# EAGLE design TEMP (EAGLE 9.4.0)
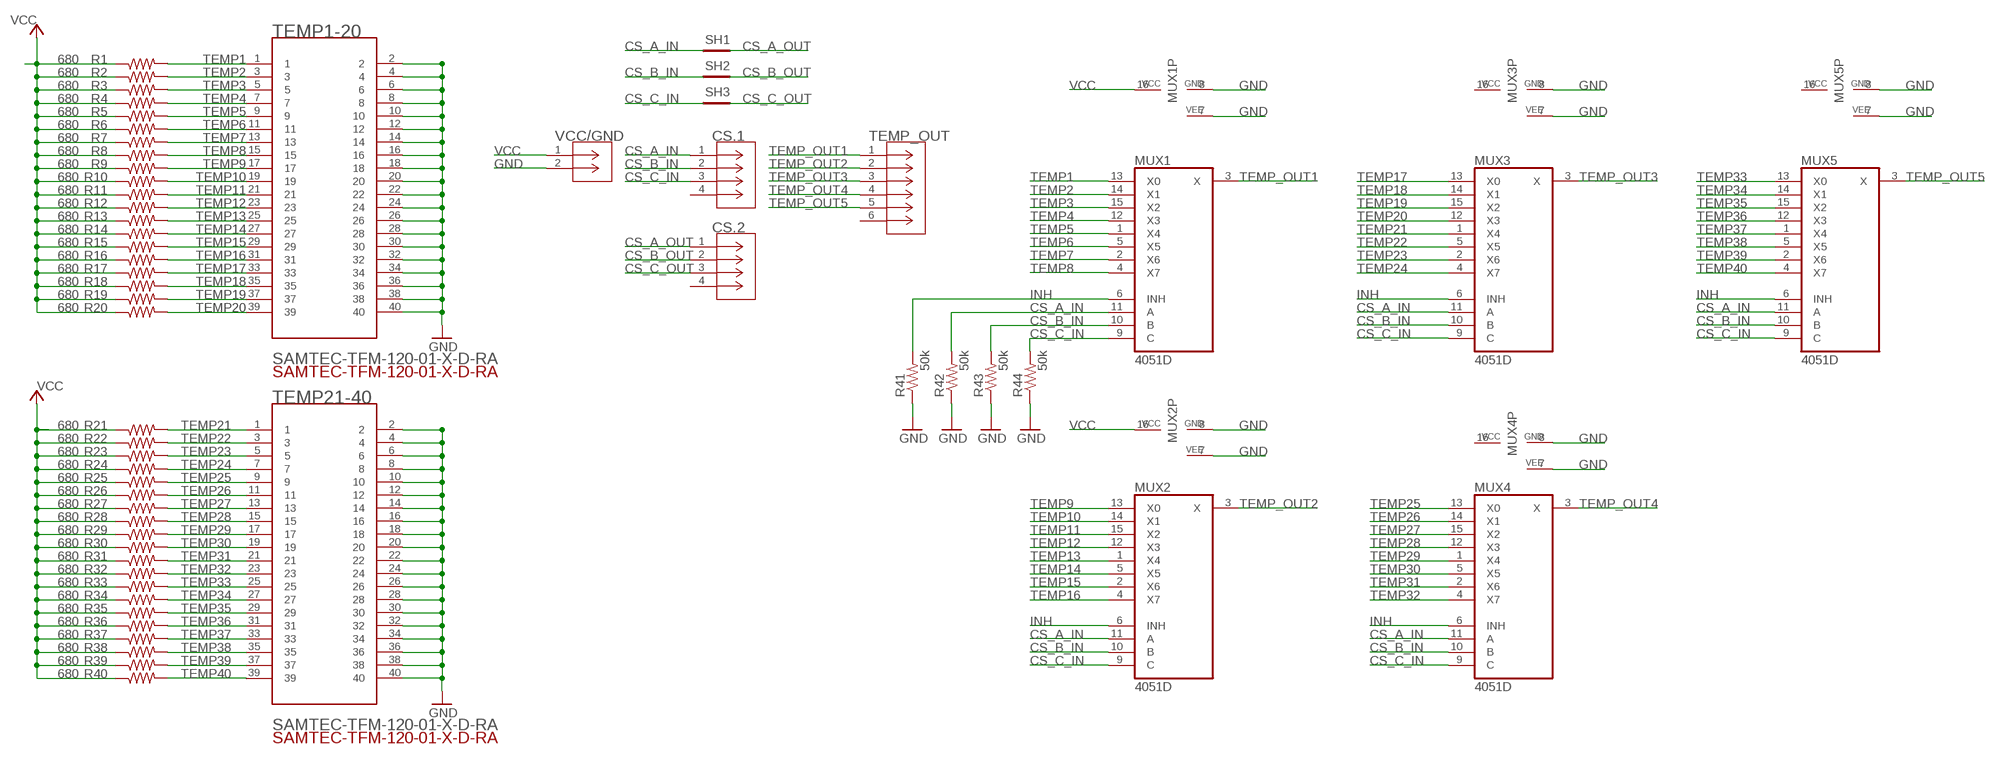
[diagram p0: schematic, sheet 1]

## Parts
CS.1  770968-1  [CONN4_770968-1]
CS.2  770968-1  [CONN4_770968-1]
MUX1  4051D  [SO16]
MUX2  4051D  [SO16]
MUX3  4051D  [SO16]
MUX4  4051D  [SO16]
MUX5  4051D  [SO16]
R1  680  R-US_R0805  [R0805]
R2  680  R-US_R0805  [R0805]
R3  680  R-US_R0805  [R0805]
R4  680  R-US_R0805  [R0805]
R5  680  R-US_R0805  [R0805]
R6  680  R-US_R0805  [R0805]
R7  680  R-US_R0805  [R0805]
R8  680  R-US_R0805  [R0805]
R9  680  R-US_R0805  [R0805]
R10  680  R-US_R0805  [R0805]
R11  680  R-US_R0805  [R0805]
R12  680  R-US_R0805  [R0805]
R13  680  R-US_R0805  [R0805]
R14  680  R-US_R0805  [R0805]
R15  680  R-US_R0805  [R0805]
R16  680  R-US_R0805  [R0805]
R17  680  R-US_R0805  [R0805]
R18  680  R-US_R0805  [R0805]
R19  680  R-US_R0805  [R0805]
R20  680  R-US_R0805  [R0805]
R21  680  R-US_R0805  [R0805]
R22  680  R-US_R0805  [R0805]
R23  680  R-US_R0805  [R0805]
R24  680  R-US_R0805  [R0805]
R25  680  R-US_R0805  [R0805]
R26  680  R-US_R0805  [R0805]
R27  680  R-US_R0805  [R0805]
R28  680  R-US_R0805  [R0805]
R29  680  R-US_R0805  [R0805]
R30  680  R-US_R0805  [R0805]
R31  680  R-US_R0805  [R0805]
R32  680  R-US_R0805  [R0805]
R33  680  R-US_R0805  [R0805]
R34  680  R-US_R0805  [R0805]
R35  680  R-US_R0805  [R0805]
R36  680  R-US_R0805  [R0805]
R37  680  R-US_R0805  [R0805]
R38  680  R-US_R0805  [R0805]
R39  680  R-US_R0805  [R0805]
R40  680  R-US_R0805  [R0805]
R41  50k  R-US_R0805  [R0805]
R42  50k  R-US_R0805  [R0805]
R43  50k  R-US_R0805  [R0805]
R44  50k  R-US_R0805  [R0805]
SH1  SHORTT5  [SHORT_TOP-50]
SH2  SHORTT5  [SHORT_TOP-50]
SH3  SHORTT5  [SHORT_TOP-50]
TEMP1-20  SAMTEC-TFM-120-01-X-D-RA  [SAMTEC-TFM-120-01-X-D-RA]
TEMP21-40  SAMTEC-TFM-120-01-X-D-RA  [SAMTEC-TFM-120-01-X-D-RA]
TEMP_OUT  1-770969-0  [CON6_2X3_P163_RAMNL]
VCC/GND  770966-1  [CONN2_770966-1]

## Nets
CS_A_IN: CS.1.1 MUX1.11(A) MUX2.11(A) MUX3.11(A) MUX4.11(A) MUX5.11(A) R42.2 SH1.1
CS_A_OUT: CS.2.1 SH1.2
CS_B_IN: CS.1.2 MUX1.10(B) MUX2.10(B) MUX3.10(B) MUX4.10(B) MUX5.10(B) R43.2 SH2.1
CS_B_OUT: CS.2.2 SH2.2
CS_C_IN: CS.1.3 MUX1.9(C) MUX2.9(C) MUX3.9(C) MUX4.9(C) MUX5.9(C) R44.2 SH3.1
CS_C_OUT: CS.2.3 SH3.2
GND: MUX1.7(VEE) MUX1.8(GND) MUX2.7(VEE) MUX2.8(GND) MUX3.7(VEE) MUX3.8(GND) MUX4.7(VEE) MUX4.8(GND) MUX5.7(VEE) MUX5.8(GND) R41.1 R42.1 R43.1 R44.1 TEMP1-20.2 TEMP1-20.4 TEMP1-20.6 TEMP1-20.8 TEMP1-20.10 TEMP1-20.12 TEMP1-20.14 TEMP1-20.16 TEMP1-20.18 TEMP1-20.20 TEMP1-20.22 TEMP1-20.24 TEMP1-20.26 TEMP1-20.28 TEMP1-20.30 TEMP1-20.32 TEMP1-20.34 TEMP1-20.36 TEMP1-20.38 TEMP1-20.40 TEMP21-40.2 TEMP21-40.4 TEMP21-40.6 TEMP21-40.8 TEMP21-40.10 TEMP21-40.12 TEMP21-40.14 TEMP21-40.16 TEMP21-40.18 TEMP21-40.20 TEMP21-40.22 TEMP21-40.24 TEMP21-40.26 TEMP21-40.28 TEMP21-40.30 TEMP21-40.32 TEMP21-40.34 TEMP21-40.36 TEMP21-40.38 TEMP21-40.40 VCC/GND.2
INH: MUX1.6(INH) MUX2.6(INH) MUX3.6(INH) MUX4.6(INH) MUX5.6(INH) R41.2
TEMP1: MUX1.13(X0) R1.2 TEMP1-20.1
TEMP2: MUX1.14(X1) R2.2 TEMP1-20.3
TEMP3: MUX1.15(X2) R3.2 TEMP1-20.5
TEMP4: MUX1.12(X3) R4.2 TEMP1-20.7
TEMP5: MUX1.1(X4) R5.2 TEMP1-20.9
TEMP6: MUX1.5(X5) R6.2 TEMP1-20.11
TEMP7: MUX1.2(X6) R7.2 TEMP1-20.13
TEMP8: MUX1.4(X7) R8.2 TEMP1-20.15
TEMP9: MUX2.13(X0) R9.2 TEMP1-20.17
TEMP10: MUX2.14(X1) R10.2 TEMP1-20.19
TEMP11: MUX2.15(X2) R11.2 TEMP1-20.21
TEMP12: MUX2.12(X3) R12.2 TEMP1-20.23
TEMP13: MUX2.1(X4) R13.2 TEMP1-20.25
TEMP14: MUX2.5(X5) R14.2 TEMP1-20.27
TEMP15: MUX2.2(X6) R15.2 TEMP1-20.29
TEMP16: MUX2.4(X7) R16.2 TEMP1-20.31
TEMP17: MUX3.13(X0) R17.2 TEMP1-20.33
TEMP18: MUX3.14(X1) R18.2 TEMP1-20.35
TEMP19: MUX3.15(X2) R19.2 TEMP1-20.37
TEMP20: MUX3.12(X3) R20.2 TEMP1-20.39
TEMP21: MUX3.1(X4) R21.2 TEMP21-40.1
TEMP22: MUX3.5(X5) R22.2 TEMP21-40.3
TEMP23: MUX3.2(X6) R23.2 TEMP21-40.5
TEMP24: MUX3.4(X7) R24.2 TEMP21-40.7
TEMP25: MUX4.13(X0) R25.2 TEMP21-40.9
TEMP26: MUX4.14(X1) R26.2 TEMP21-40.11
TEMP27: MUX4.15(X2) R27.2 TEMP21-40.13
TEMP28: MUX4.12(X3) R28.2 TEMP21-40.15
TEMP29: MUX4.1(X4) R29.2 TEMP21-40.17
TEMP30: MUX4.5(X5) R30.2 TEMP21-40.19
TEMP31: MUX4.2(X6) R31.2 TEMP21-40.21
TEMP32: MUX4.4(X7) R32.2 TEMP21-40.23
TEMP33: MUX5.13(X0) R33.2 TEMP21-40.25
TEMP34: MUX5.14(X1) R34.2 TEMP21-40.27
TEMP35: MUX5.15(X2) R35.2 TEMP21-40.29
TEMP36: MUX5.12(X3) R36.2 TEMP21-40.31
TEMP37: MUX5.1(X4) R37.2 TEMP21-40.33
TEMP38: MUX5.5(X5) R38.2 TEMP21-40.35
TEMP39: MUX5.2(X6) R39.2 TEMP21-40.37
TEMP40: MUX5.4(X7) R40.2 TEMP21-40.39
TEMP_OUT1: MUX1.3(X) TEMP_OUT.1
TEMP_OUT2: MUX2.3(X) TEMP_OUT.2
TEMP_OUT3: MUX3.3(X) TEMP_OUT.3
TEMP_OUT4: MUX4.3(X) TEMP_OUT.4
TEMP_OUT5: MUX5.3(X) TEMP_OUT.5
VCC: MUX1.16(VCC) MUX2.16(VCC) R1.1 R2.1 R3.1 R4.1 R5.1 R6.1 R7.1 R8.1 R9.1 R10.1 R11.1 R12.1 R13.1 R14.1 R15.1 R16.1 R17.1 R18.1 R19.1 R20.1 R21.1 R22.1 R23.1 R24.1 R25.1 R26.1 R27.1 R28.1 R29.1 R30.1 R31.1 R32.1 R33.1 R34.1 R35.1 R36.1 R37.1 R38.1 R39.1 R40.1 VCC/GND.1
Unconnected: CS.1.4 CS.2.4 TEMP_OUT.6

## Power pins joined to a net without a drawn wire
VCC: MUX3.16(VCC) MUX4.16(VCC) MUX5.16(VCC)

## Library data of the parts
CS.1 CS.2 = IowaFormula:770968-1; MANUFACTURER_PART_NUMBER: 7709681; VENDOR: TE Connectivity
MUX1-MUX5 = 40xx:4051: 8-channel ANALOG MULTIPLEXER
R1-R44 = rcl:R-US_: RESISTOR, American symbol; SPICEPREFIX: R
SH1-SH3 = shorts:SHORT: Short between two nets; BOM: no
TEMP1-20 TEMP21-40 = SAMTEC-TFM-120-01-X-D-RA:SAMTEC-TFM-120-01-X-D-RA
TEMP_OUT = IowaFormula:1-770969-0; MANUFACTURER_PART_NUMBER: 17709690; VENDOR: TE Connectivity
VCC/GND = IowaFormula:770966-1; MANUFACTURER_PART_NUMBER: 7709661; VENDOR: TE Connectivity

## Board
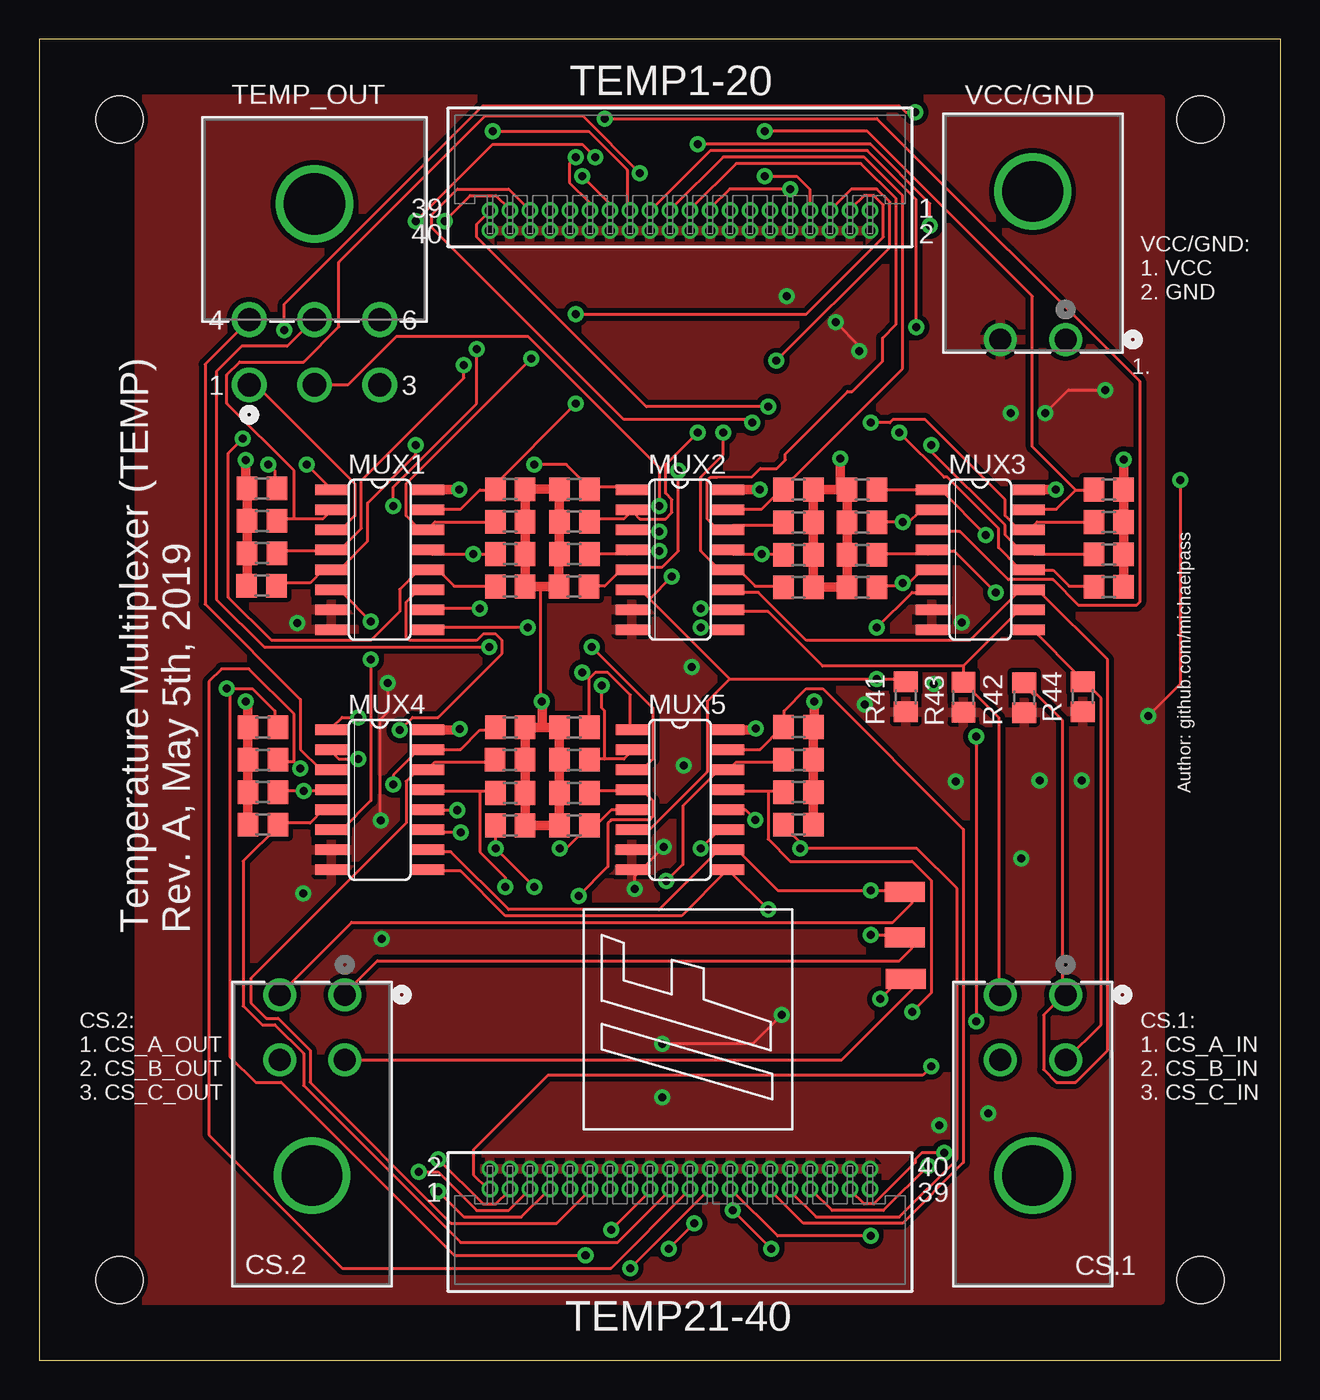
[diagram p1: board, top side]
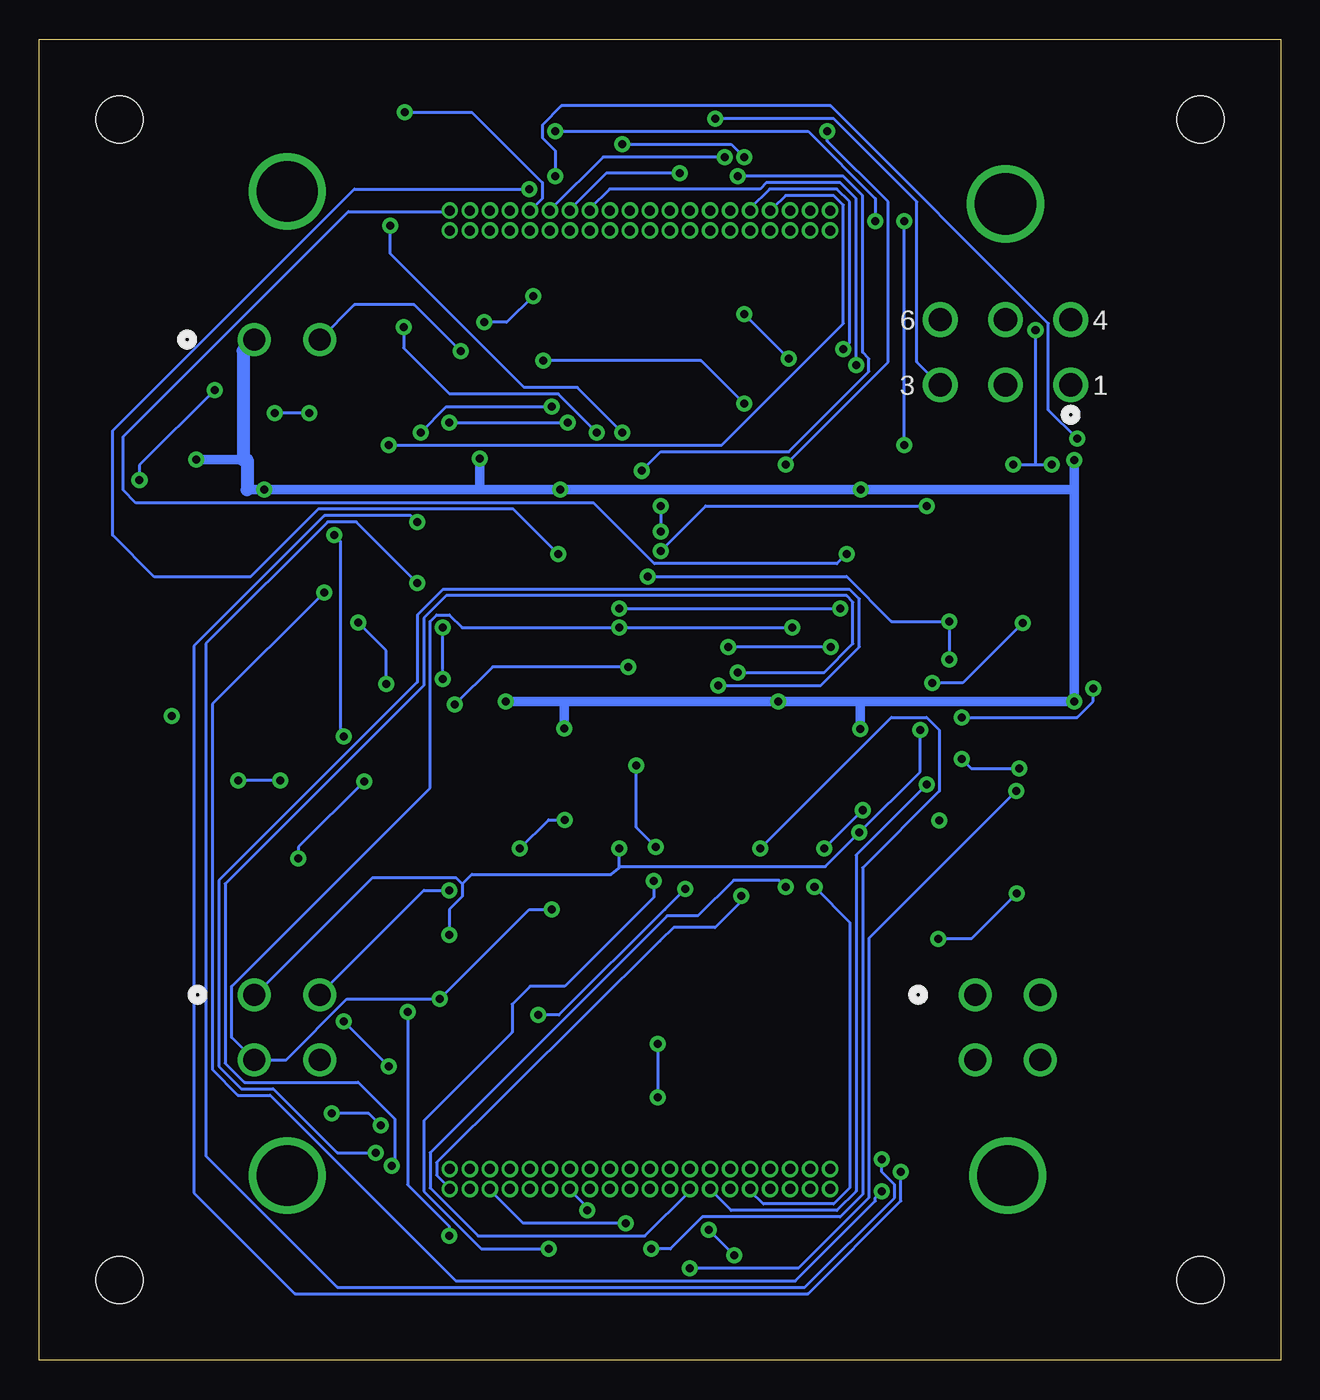
[diagram p2: board, bottom side, seen from below]

Size 78.74 x 83.82 mm. Coordinates in mm from the lower left corner, seen from the top.
Outline: 0,0 78.74,0 78.74,83.82 0,83.82 0,0
Copper layers (1*16): Top 0.035mm / dielectric 1.5mm / Bottom 0.035mm
Design rules "default *": minimum track width 8mil, minimum drill 20mil, track to track 8mil, track to pad 8mil, pad to pad 8mil, via to via 8mil, smd to smd 8mil, copper to edge 10mil, drill to drill 8mil, minimum pad ring 8mil, minimum via ring 10mil, stop-mask expansion 4mil, vias tented up to drill 25mil, thermal gap 10mil
Holes 3 mm at 73.66,78.74 5.08,78.74 5.08,5.08 73.66,5.08

### Footprints (pad centres in the part's own frame; a part is rotated, then mirrored left to right if it is on the bottom)
CONN4_770968-1 = drill 1.397 pad 1.905: 1 4.14,4.14; 2 0,4.14; 3 4.14,0; 4 0,0 | drill 3.861 pad 3.861: 5 2.057,-7.341
SO16 = smd 0.66 x 2.032: 1 -4.445,-3.073; 2 -3.175,-3.073; 3 -1.905,-3.073; 4 -0.635,-3.073; 5 0.635,-3.073; 6 1.905,-3.073; 7 3.175,-3.073; 8 4.445,-3.073; 9 4.445,3.073; 10 3.175,3.073; 11 1.905,3.073; 12 0.635,3.073; 13 -0.635,3.073; 14 -1.905,3.073; 15 -3.175,3.073; 16 -4.445,3.073
R0805 = smd 1.3 x 1.5: 1 -0.95,0; 2 0.95,0
SHORT_TOP-50 = smd 1.27 x 1.27: 1 0.635,0; 2 -0.635,0
SAMTEC-TFM-120-01-X-D-RA = drill 0.635 pad 1.016: 1 -12.065,3.238; 2 -12.065,4.508; 3 -10.795,3.238; 4 -10.795,4.508; 5 -9.525,3.238; 6 -9.525,4.508; 7 -8.255,3.238; 8 -8.255,4.508; 9 -6.985,3.238; 10 -6.985,4.508; 11 -5.715,3.238; 12 -5.715,4.508; 13 -4.445,3.238; 14 -4.445,4.508; 15 -3.175,3.238; 16 -3.175,4.508; 17 -1.905,3.238; 18 -1.905,4.508; 19 -0.635,3.238; 20 -0.635,4.508; 21 0.635,3.238; 22 0.635,4.508; 23 1.905,3.238; 24 1.905,4.508; 25 3.175,3.238; 26 3.175,4.508; 27 4.445,3.238; 28 4.445,4.508; 29 5.715,3.238; 30 5.715,4.508; 31 6.985,3.238; 32 6.985,4.508; 33 8.255,3.238; 34 8.255,4.508; 35 9.525,3.238; 36 9.525,4.508; 37 10.795,3.238; 38 10.795,4.508; 39 12.065,3.238; 40 12.065,4.508
CON6_2X3_P163_RAMNL = drill 1.473 pad 1.981: 1 -8.28,-4.14; 2 -4.14,-4.14; 3 0,-4.14; 4 -8.28,0; 5 -4.14,0; 6 0,0 | drill 3.912 pad 3.912: 7 -4.14,7.341
CONN2_770966-1 = drill 1.397 pad 1.905: 1 -4.14,0; 2 0,0 | drill 3.861 pad 3.861: 3 -2.057,-9.398

### Placement (x,y rotation side)
CS.1  60.96,19.05 0 top
CS.2  15.24,19.05 0 top
MUX1  21.59,50.8 270 top
MUX2  40.64,50.8 270 top
MUX3  59.69,50.8 270 top
MUX4  21.59,35.56 270 top
MUX5  40.64,35.56 270 top
R1  29.87,51.16 180 top
R2  29.87,53.21 180 top
R3  29.87,55.27 180 top
R4  29.87,49.1 180 top
R5  14.12,55.32 0 top
R6  14.1,49.15 0 top
R7  14.12,53.26 0 top
R8  14.12,51.21 0 top
R9  48.16,51.1 180 top
R10  48.16,53.16 180 top
R11  48.16,55.24 180 top
R12  48.16,49.05 180 top
R13  33.93,55.27 0 top
R14  33.91,49.1 0 top
R15  33.93,53.21 0 top
R16  33.93,51.16 0 top
R17  67.84,51.13 180 top
R18  67.84,53.19 180 top
R19  67.84,55.24 180 top
R20  67.84,49.07 180 top
R21  52.2,55.24 0 top
R22  52.2,49.05 0 top
R23  52.2,53.16 0 top
R24  52.2,51.1 0 top
R25  29.87,35.99 180 top
R26  29.84,38.1 180 top
R27  29.87,40.16 180 top
R28  29.87,33.93 180 top
R29  14.17,40.16 0 top
R30  14.17,33.99 0 top
R31  14.17,38.1 0 top
R32  14.17,36.04 0 top
R33  48.16,36.04 180 top
R34  48.16,38.1 180 top
R35  48.16,40.18 180 top
R36  48.16,33.99 180 top
R37  33.93,40.16 0 top
R38  33.93,33.93 0 top
R39  33.93,38.1 0 top
R40  33.93,35.99 0 top
R41  54.97,42.09 90 top
R42  62.48,42.04 90 top
R43  58.62,42.06 90 top
R44  66.19,42.11 90 top
SH1  54.89,26.82 180 top
SH2  54.89,29.72 180 top
SH3  54.97,24.21 180 top
TEMP1-20  40.64,76.2 180 top
TEMP21-40  40.64,7.62 0 top
TEMP_OUT  21.59,66.04 0 top
VCC/GND  60.96,64.77 180 top

### Tracks (layer width: path | path; a pad name or v marks a point on that pad's centre or on a via)
CS_A_IN  (via drill 0.51)
  Top 0.203: MUX2.11 43.79,48.72 45.62,48.72 48.67,45.67 59.03,45.67 62.08,48.72 62.69,48.72 MUX3.11 62.89,48.72 63.5,48.72 67.77,44.45 67.77,19.66 65.73,17.63 64.52,17.63 63.7,18.44 63.7,21.89 64.92,23.11 CS.1.1 64.92,23.32 64.92,40.59 63.3,42.22 63.09,42.22 62.48,42.82 R42.2 | v52.73,26.98 54.15,26.98 SH1.1 | v26.72,33.48 24.69,33.48 MUX4.11 | v41.96,32.46 42.98,33.48 43.59,33.48 MUX5.11 | v22.86,39.98 23.67,40.79 25.3,40.79 29.36,44.86 29.36,45.67 28.96,46.08 28.14,46.08 27.74,45.67 23.47,45.67 23.27,45.87 23.27,48.11 23.88,48.72 24.49,48.72 MUX1.11
  Bottom 0.203: v52.73,26.98 52.73,28.6 51.92,29.41 51.92,30.23 | 51.92,30.23 52.32,30.63 57.61,30.63 64.92,23.32 CS.1.1 | 41.96,31.32 28.88,31.32 v26.72,33.48 22.86,37.34 v22.86,39.98 | 51.92,30.23 51.31,30.84 42.45,30.84 41.96,31.23 41.96,31.32 | 41.96,31.32 v41.96,32.46
CS_A_OUT
  Top 0.203: SH1.2 55.37,26.77 55.37,26.16 54.56,25.35 21.44,25.35 19.41,23.32 CS.2.1
CS_B_IN  (via drill 0.51)
  Top 0.203: SH2.1 54.15,29.82 v52.73,29.82 46.84,29.82 44.4,32.26 43.79,32.26 MUX5.10 43.59,32.26 42.98,32.26 39.32,28.6 29.77,28.6 26.11,32.26 24.69,32.26 MUX4.10 | v27.94,47.7 24.69,47.7 MUX1.10 | v41.96,47.7 43.59,47.7 MUX2.10 43.79,47.5 46.23,47.5 49.68,44.04 58.62,44.04 | 58.62,44.04 58.62,43.03 | 58.62,44.04 62.08,47.5 62.69,47.5 MUX3.10 | 58.62,43.03 60.86,40.79 60.86,23.32 CS.1.2 | 58.62,43.03 R43.2
  Bottom 0.203: v41.96,47.7 v27.94,47.7 | v52.73,29.82 54.36,29.82 60.86,23.32 CS.1.2
CS_B_OUT
  Top 0.203: SH2.2 55.37,29.62 55.37,29.01 54.15,27.79 19.81,27.79 15.34,23.32 CS.2.2
CS_C_IN  (via drill 0.51)
  Top 0.203: MUX4.9 24.69,31.04 26.72,31.04 29.57,28.19 40.74,28.19 43.59,31.04 MUX5.9 v46.23,28.6 | v30.99,46.48 24.69,46.48 MUX1.9 | v41.96,46.48 43.59,46.48 MUX2.9 | MUX3.9 62.89,46.48 66.14,43.23 R44.2 66.34,43.03 67.36,42.01 67.36,21.29 65.13,19.05 CS.1.3 | v53.34,22.91 54.15,23.72 54.15,24.13 SH3.1
  Bottom 0.203: v30.99,46.48 v41.96,46.48 51.92,46.48 52.73,47.3 53.54,47.3 53.95,46.89 53.95,36.32 66.55,23.72 66.55,20.47 65.13,19.05 CS.1.3 63.09,19.05 59.23,22.91 v53.34,22.91 47.65,28.6 v46.23,28.6
CS_C_OUT
  Top 0.203: CS.2.3 50.9,19.05 55.58,23.72 55.58,24.13 SH3.2
GND  (via drill 0.51)
  Top 0.203: v47.09,21.89 45.26,20.07 v39.52,20.07 | v37.77,29.9 37.77,30.71 v39.62,32.56 | v22.1,42.98 22.1,41.15 21.59,40.64 21.59,34.31 v21.64,34.27 | v50.52,65.86 52.02,64.36 v52.02,64.03 | v63.8,60.1 65.28,61.57 v67.61,61.57 | v72.39,55.85 72.39,42.9 v70.36,40.87
  Bottom 0.203: v41.38,43.99 49.99,43.99 v52.38,41.6 | v37.77,29.9 39.06,28.6 39.08,28.6 45.79,21.89 v47.09,21.89 | v39.52,20.07 v39.52,16.69 | v39.62,32.56 40.87,33.81 v40.87,37.74 | v16.74,29.62 19.61,26.75 v21.72,26.75 | v58.14,36.73 62.31,32.56 v62.31,31.85 | v57.1,14.88 57.86,15.65 v60.2,15.65 | v63.45,36.78 v66.12,36.78 | v56.74,42.9 56.74,45.03 v58.52,46.81 | v16.36,46.79 20.17,42.98 v22.1,42.98 | v47.42,67.54 49.1,65.86 v50.52,65.86 | v52.02,64.03 54.97,66.98 58.75,66.98 VCC/GND.2 | v61.62,60.1 v63.8,60.1 | v67.61,61.57 72.39,56.79 v72.39,55.85
  pour Top (isolate 0.305): 6.35,3.81 6.35,80.01 71.12,80.01 71.12,3.81
INH  (via drill 0.51)
  Top 0.203: v21.03,44.45 21.03,35.51 19.2,33.68 18.59,33.68 MUX4.6 | v21.03,46.89 19.2,48.72 18.59,48.72 MUX1.6 | 43.79,43.23 v53.14,43.23 54.97,43.23 R41.2 | 38.71,48.31 38.3,48.72 37.69,48.72 MUX2.6 | 38.71,48.31 43.79,43.23 | 43.79,43.23 42.37,41.81 42.37,37.34 38.71,33.68 37.69,33.68 MUX5.6 | v53.14,46.48 55.37,48.72 56.59,48.72 MUX3.6 | 38.71,48.31 v40.13,49.73
  Bottom 0.203: v21.03,44.45 v21.03,46.89 24.69,46.89 27.53,49.73 v40.13,49.73 | v53.14,43.23 v53.14,46.48
TEMP1  (via drill 0.51)
  Top 0.203: R1.2 v27.53,51.16 24.89,51.16 24.69,51.36 MUX1.13
  Bottom 0.203: v27.53,51.16 28.14,50.55 39.73,50.55 43.59,54.41 72.62,54.41 73.43,55.22 73.43,58.6 59.13,72.9 52.73,72.9 TEMP1-20.1
TEMP2  (via drill 0.51)
  Top 0.203: R2.2 28.75,53.19 25.09,53.19 24.69,52.78 MUX1.14 24.49,52.78 24.08,52.78 23.27,53.59 23.27,55.63 v31.19,63.55 | v34.04,66.4 48.67,66.4 53.54,71.27 53.54,73.3 52.93,73.91 52.32,73.91 51.51,73.1 TEMP1-20.3
  Bottom 0.203: v31.19,63.55 v34.04,66.4
TEMP3  (via drill 0.51)
  Top 0.203: MUX1.15 24.69,54 26.72,54 27.94,55.22 28.75,55.22 R3.2 28.75,55.42 v34.04,60.71 | v46.76,63.42 53.95,70.61 53.95,73.51 53.14,74.32 51.51,74.32 50.29,73.1 TEMP1-20.5
  Bottom 0.203: v46.76,63.42 36.75,63.42 v34.04,60.71
TEMP4  (via drill 0.51)
  Top 0.203: R4.2 28.75,49.12 26.31,49.12 25.3,50.14 24.69,50.14 MUX1.12 24.49,50.14 24.08,50.14 22.86,48.92 22.86,47.5 21.03,45.67 14.73,45.67 11.99,48.41 11.99,57.56 v12.9,58.47 | v46.02,75.13 48.06,75.13 48.87,74.32 48.87,73.1 TEMP1-20.7
  Bottom 0.203: v46.02,75.13 46.02,76.76 46.84,77.57 46.84,78.38 45.62,79.6 28.55,79.6 14.73,65.79 14.73,60.3 v12.9,58.47
TEMP5  (via drill 0.51)
  Top 0.203: v14.53,56.84 14.94,56.44 14.94,55.42 R5.2 | v16.97,56.84 18.39,55.42 MUX1.1 | v55.58,79.2 54.97,79.2 54.56,79.6 28.12,79.6 15.54,67.03 v15.54,65.38
  Bottom 0.203: v16.97,56.84 15.54,56.84 | 15.54,56.84 v14.53,56.84 | v55.58,79.2 51.31,79.2 46.84,74.73 46.84,73.71 47.45,73.1 TEMP1-20.9 | 15.54,56.84 v15.54,65.38
TEMP6  (via drill 0.51)
  Top 0.203: R6.2 15.14,49.33 17.17,49.33 17.98,50.14 18.39,50.14 MUX1.5 18.59,50.34 19.2,50.34 20.83,51.97 20.83,54.41 23.88,57.45 v23.88,58.06 | v35.26,76.35 34.44,77.17 28.75,77.17 v23.88,72.29
  Bottom 0.203: v35.26,76.35 42.98,76.35 46.23,73.1 TEMP1-20.11 | v23.88,58.06 v23.88,72.29
TEMP7  (via drill 0.51)
  Top 0.203: 16.15,53.39 17.98,53.39 18.39,53.8 MUX1.2 | 16.15,53.39 15.14,53.39 R7.2 | v38.1,75.34 34.47,78.97 28.3,78.97 19,69.67 19,65.58 16.76,63.35 12.7,63.35 11.89,62.53 11.89,60.71 16.15,56.44 16.15,53.39
  Bottom 0.203: v38.1,75.34 42.77,75.34 45.01,73.1 TEMP1-20.13
TEMP8  (via drill 0.51)
  Top 0.203: R8.2 15.14,51.36 18.39,51.36 MUX1.4 18.59,51.56 19.2,51.56 20.42,52.78 20.42,55.83 26.92,62.33 v26.92,63.14
  Bottom 0.203: v26.92,63.14 26.92,73.71 27.94,74.73 32.61,74.73 33.02,74.32 42.57,74.32 43.79,73.1 TEMP1-20.15
TEMP9  (via drill 0.51)
  Top 0.203: MUX2.13 43.99,51.16 v45.82,51.16 47.04,51.16 R9.2 | v47.65,74.32 43.79,74.32 42.57,73.1 TEMP1-20.17
  Bottom 0.203: v47.65,74.32 58.75,74.32 74.09,58.98 74.09,52.35 71.45,49.71 65.35,49.71 61.06,54 48.67,54 v45.82,51.16
TEMP10
  Top 0.203: R10.2 47.04,52.98 43.99,52.98 MUX2.14 43.59,52.78 42.98,52.78 42.37,53.39 42.37,55.83 42.57,56.03 42.98,56.03 45.21,56.06 45.74,56.59 46.79,56.59 47.32,57.12 47.32,57.51 51.28,61.47 51.56,61.47 53.49,63.4 53.49,64.87 54.36,65.73 54.36,73.71 52.12,75.95 44.2,75.95 41.35,73.1 TEMP1-20.19
TEMP11
  Top 0.203: MUX2.15 43.79,54 45.82,54 47.04,55.22 R11.2 47.24,55.42 54.76,62.94 54.76,73.91 52.32,76.35 43.38,76.35 40.13,73.1 TEMP1-20.21
TEMP12  (via drill 0.51)
  Top 0.203: R12.2 47.04,49.12 45.41,49.12 44.4,50.14 43.79,50.14 MUX2.12 43.59,50.34 42.98,50.34 41.96,51.36 41.96,56.03 43.38,57.45 v43.38,58.88 | v55.63,65.56 55.63,73.66 52.53,76.76 42.57,76.76 38.91,73.1 TEMP1-20.23
  Bottom 0.203: v55.63,65.56 55.63,64.24 52.7,61.32 45.82,61.32 v43.38,58.88
TEMP13  (via drill 0.51)
  Top 0.203: MUX2.1 37.49,55.42 35.05,55.42 R13.2 34.85,55.42 33.43,56.84 v31.39,56.84 | v28.75,77.98 34.85,77.98 37.29,75.54 37.29,73.1 TEMP1-20.25
  Bottom 0.203: v28.75,77.98 28.75,77.37 24.89,73.51 24.89,63.35 v31.39,56.84
TEMP14  (via drill 0.51)
  Top 0.203: R14.2 35.05,49.12 35.87,49.12 36.88,50.14 37.49,50.14 MUX2.5 37.69,50.34 39.52,50.34 40.54,51.36 v40.54,56.44 | v34.44,75.13 36.07,73.51 36.07,73.1 TEMP1-20.27
  Bottom 0.203: v34.44,75.13 27.74,75.13 26.52,73.91 26.52,63.96 26.11,63.55 26.11,62.74 31.19,57.66 39.32,57.66 v40.54,56.44
TEMP15  (via drill 0.51)
  Top 0.203: R15.2 35.05,53.39 37.08,53.39 37.49,53.8 MUX2.2 37.69,53.8 38.1,53.39 39.73,53.39 40.13,53.8 40.13,54.61 39.73,55.02 39.73,56.84 v41.76,58.88 | v34.04,76.35 33.63,75.95 33.63,74.73 34.85,73.51 34.85,73.1 TEMP1-20.29 | v41.76,77.17 52.73,77.17 56.49,73.41 v56.49,71.98
  Bottom 0.203: v34.04,76.35 34.85,77.17 v41.76,77.17 | v56.49,71.98 56.49,70.23 47.98,61.72 44.6,61.72 v41.76,58.88
TEMP16  (via drill 0.51)
  Top 0.203: R16.2 37.29,51.16 MUX2.4 37.69,51.36 v39.32,51.36 | v27.74,64.16 27.74,60.71 22.45,55.42 v22.45,54.2
  Bottom 0.203: v27.74,64.16 27.33,64.57 27.33,73.51 28.14,74.32 32.41,74.32 33.63,73.1 TEMP1-20.31 | v22.45,54.2 36.47,54.2 v39.32,51.36
TEMP17  (via drill 0.51)
  Top 0.203: R17.2 66.75,51.16 63.09,51.16 62.89,51.36 MUX3.13 62.69,51.56 62.08,51.56 61.27,52.38 61.27,52.98 56.59,57.66 v56.59,58.06
  Bottom 0.203: v56.59,58.06 35.46,58.06 27.74,65.79 27.74,73.3 28.35,73.91 31.39,73.91 32.21,73.1 TEMP1-20.33
TEMP18  (via drill 0.51)
  Top 0.203: R18.2 63.3,53.19 62.89,52.78 MUX3.14 62.69,52.78 62.08,52.78 61.27,53.59 61.27,54.61 56.19,59.69 54.15,59.69 53.95,59.49 v52.73,59.49 | v45.21,59.49 45.01,59.69 37.08,59.69 24.89,71.88 24.89,72.69 26.52,74.32 29.77,74.32 30.99,73.1 TEMP1-20.35
  Bottom 0.203: v52.73,59.49 v45.21,59.49
TEMP19  (via drill 0.51)
  Top 0.203: 65.73,55.22 66.75,55.22 R19.2 | 65.73,55.22 64.52,54 62.89,54 MUX3.15 | v25.7,72.29 27.33,73.91 28.96,73.91 29.77,73.1 TEMP1-20.37 | v46.02,77.98 52.53,77.98 62.99,67.51 62.99,57.96 65.73,55.22
  Bottom 0.203: v25.7,72.29 25.7,73.71 29.97,77.98 v46.02,77.98
TEMP20  (via drill 0.51)
  Top 0.203: R20.2 66.75,49.12 65.33,49.12 64.31,50.14 62.89,50.14 MUX3.12 62.69,50.34 62.08,50.34 60.86,51.56 60.86,52.78 57.61,56.03 57.4,56.03 v54.56,58.88 | v46.23,60.5 38.51,60.5 27.74,71.27 27.74,72.08 28.55,72.9 TEMP1-20.39
  Bottom 0.203: v46.23,60.5 52.93,60.5 v54.56,58.88
TEMP21  (via drill 0.51)
  Top 0.203: R21.2 53.34,55.22 56.59,55.22 MUX3.1 56.79,55.22 57.2,55.22 v60.05,52.38 | TEMP21-40.1 28.44,10.86 27.53,11.76 27.53,13.36 32.26,18.09 56.03,18.09 v56.59,18.64 | v59.44,39.57 v59.44,21.49
  Bottom 0.203: v59.44,21.49 v56.59,18.64 | v59.44,39.57 59.64,39.78 59.64,51.97 v60.05,52.38
TEMP22  (via drill 0.51)
  Top 0.203: 54.76,49.12 54.97,49.12 55.98,50.14 56.59,50.14 MUX3.5 | 54.76,49.12 53.34,49.12 R22.2 | v25.3,12.75 28.14,9.91 28.96,9.91 29.77,10.72 TEMP21-40.3 | 54.76,49.12 v54.76,49.33
  Bottom 0.203: v25.3,12.75 25.3,11.94 24.49,11.12 24.49,10.31 30.18,4.62 59.84,4.62 68.17,12.95 68.17,45.47 60.45,53.19 58.62,53.19 v54.76,49.33
TEMP23  (via drill 0.51)
  Top 0.203: R23.2 53.34,53.19 v54.76,53.19 55.17,53.19 55.78,53.8 56.59,53.8 MUX3.2 | v24.08,11.94 25.3,11.94 27.74,9.5 29.77,9.5 30.99,10.72 TEMP21-40.5
  Bottom 0.203: v24.08,11.94 24.08,10.11 29.97,4.22 62.53,4.22 68.94,10.62 68.94,45.31 60.66,53.59 55.17,53.59 v54.76,53.19
TEMP24  (via drill 0.51)
  Top 0.203: R24.2 53.34,51.16 56.39,51.16 56.59,51.36 MUX3.4 56.79,51.36 58.04,51.36 v60.68,48.72 | v25.3,10.72 26.92,9.09 30.58,9.09 32.21,10.72 TEMP21-40.7
  Bottom 0.203: v25.3,10.72 25.7,10.31 25.7,10.11 30.79,5.03 52.32,5.03 64.11,16.82 66.14,16.82 67.77,18.44 67.77,41.63 v60.68,48.72
TEMP25  (via drill 0.51)
  Top 0.203: 27.94,36.12 24.69,36.12 MUX4.13 | 27.94,36.12 28.75,36.12 R25.2 | v29.57,30.02 29.57,30.63 27.94,32.26 27.94,36.12
  Bottom 0.203: v29.57,30.02 27.33,27.79 27.33,10.92 28.35,9.91 32.82,9.91 33.63,10.72 TEMP21-40.9
TEMP26
  Top 0.203: R26.2 28.75,37.95 25.09,37.95 24.69,37.54 MUX4.14 24.49,37.34 23.88,37.34 23.27,36.73 23.27,34.09 13.41,24.23 13.41,22.68 14.4,21.69 15.14,21.69 17.17,19.66 17.17,17.63 26.11,8.69 32.82,8.69 34.85,10.72 TEMP21-40.11
TEMP27  (via drill 0.51)
  Top 0.203: R27.2 28.75,39.98 27.94,39.98 26.72,38.76 24.69,38.76 MUX4.15 24.49,38.56 23.88,38.56 22.45,37.13 v22.45,36.52
  Bottom 0.203: v22.45,36.52 26.92,32.05 26.92,10.72 28.14,9.5 34.85,9.5 36.07,10.72 TEMP21-40.13
TEMP28  (via drill 0.51)
  Top 0.203: v26.52,34.9 24.69,34.9 MUX4.12 | R28.2 28.96,33.88 v28.96,32.46 v31.39,30.02
  Bottom 0.203: v26.52,34.9 v28.96,32.46 | v31.39,30.02 31.83,30.45 34.7,30.45 36.96,28.19 38.91,28.19 53.95,13.16 53.95,10.92 50.9,7.87 40.34,7.87 37.49,10.72 TEMP21-40.15
TEMP29  (via drill 0.51)
  Top 0.203: 12.09,42.62 13.51,42.62 14.94,41.2 14.94,40.18 R29.2 | v20.22,40.79 19.2,40.79 18.59,40.18 MUX4.1 | v36.27,8.28 38.71,10.72 TEMP21-40.17 | v34.65,6.66 26.31,6.66 15.34,17.63 13.72,17.63 12.09,19.25 12.09,42.62 | 12.09,42.62 v11.89,42.62
  Bottom 0.203: v11.89,42.62 11.89,41.81 12.9,40.79 v20.22,40.79 | v34.65,6.66 v36.27,8.28
TEMP30
  Top 0.203: MUX4.5 18.39,34.9 17.98,34.9 17.17,34.09 15.14,34.09 R30.2 15.14,33.88 12.93,31.67 12.93,22.48 14.12,21.29 14.94,21.29 16.76,19.46 16.76,17.42 26.72,7.47 36.68,7.47 39.93,10.72 TEMP21-40.19
TEMP31  (via drill 0.51)
  Top 0.203: 16.15,37.95 15.14,37.95 R31.2 | v16.56,37.54 16.15,37.95 | v20.22,38.15 19,38.15 18.59,38.56 MUX4.2 | 16.15,37.95 16.15,41 13.28,43.87 11.56,43.87 10.74,43.05 10.74,14.3 19.2,5.84 36.27,5.84 41.15,10.72 TEMP21-40.21
  Bottom 0.203: v16.56,37.54 19.61,37.54 v20.22,38.15
TEMP32  (via drill 0.51)
  Top 0.203: R32.2 15.14,36.12 v16.76,36.12 18.39,36.12 MUX4.4 | v37.49,5.84 42.37,10.72 TEMP21-40.23
  Bottom 0.203: v37.49,5.84 30.58,5.84 26.11,10.31 26.11,26.77 v16.76,36.12
TEMP33  (via drill 0.51)
  Top 0.203: 46.23,36.12 43.79,36.12 MUX5.13 | 46.23,36.12 47.04,36.12 R33.2 | v52.73,7.87 46.84,7.87 43.99,10.72 TEMP21-40.25 | v55.37,22.1 56.59,23.32 56.59,30.43 55.37,31.65 47.65,31.65 46.23,33.07 46.23,36.12
  Bottom 0.203: v52.73,7.87 52.73,8.48 55.37,11.12 v55.37,22.1
TEMP34  (via drill 0.51)
  Top 0.203: R34.2 47.04,37.95 44.2,37.95 MUX5.14 43.59,37.34 42.98,37.34 40.82,35.18 40.82,31.45 v39.78,30.4 | v46.43,7.06 v43.99,9.5
  Bottom 0.203: v43.99,9.5 43.99,9.7 45.01,10.72 TEMP21-40.27 | v46.43,7.06 50.7,7.06 54.36,10.72 54.36,15.19 48.74,20.8 48.74,22.58 47.6,23.72 45.41,23.72 39.78,29.36 v39.78,30.4
TEMP35
  Top 0.203: MUX5.15 43.79,38.76 45.72,38.76 47.14,40.18 R35.2 47.24,40.18 47.24,41.2 48.67,42.62 49.68,42.62 58.62,33.68 58.62,12.55 54.76,8.69 48.46,8.69 46.43,10.72 TEMP21-40.29
TEMP36  (via drill 0.51)
  Top 0.203: 48.46,32.66 48.67,32.46 55.68,32.46 58.22,29.92 58.22,12.75 54.56,9.09 49.28,9.09 47.65,10.72 TEMP21-40.31 | 48.46,32.66 47.24,33.88 R36.2 | v45.41,34.29 44.81,34.9 43.79,34.9 MUX5.12 | 48.46,32.66 v48.26,32.46
  Bottom 0.203: v45.41,34.29 46.43,34.29 v48.26,32.46
TEMP37  (via drill 0.51)
  Top 0.203: 34.85,43.23 34.85,40.18 R37.2 | 34.85,43.23 35.26,43.64 36.07,43.64 37.49,42.22 37.49,40.18 MUX5.1 | v56.39,12.34 53.54,9.5 50.29,9.5 49.07,10.72 TEMP21-40.33 | 34.85,43.23 v34.44,43.64
  Bottom 0.203: v56.39,12.34 56.21,12.52 56.21,15.32 58.52,17.63 65.73,17.63 66.95,18.85 66.95,30.23 54.36,42.82 54.36,47.09 52.93,48.51 27.53,48.51 27.13,48.11 27.13,45.47 28.96,43.64 v34.44,43.64
TEMP38  (via drill 0.51)
  Top 0.203: MUX5.5 37.49,34.9 36.27,34.9 35.46,34.09 35.05,34.09 R38.2 34.85,33.88 33.43,32.46 v33.02,32.46 | v39.93,7.06 v41.55,8.69
  Bottom 0.203: v41.55,8.69 48.06,8.69 50.09,10.72 TEMP21-40.35 | v39.93,7.06 38.71,7.06 36.68,9.09 27.94,9.09 26.52,10.52 26.52,31.24 21.64,36.12 21.64,39.98 22.45,40.79 24.69,40.79 v33.02,32.46
TEMP39  (via drill 0.51)
  Top 0.203: 35.87,38.15 37.08,38.15 37.49,38.56 MUX5.2 | 35.87,38.15 35.05,38.15 R39.2 | v57.4,13.16 55.98,13.16 55.58,12.75 55.58,12.55 52.93,9.91 52.32,9.91 51.51,10.72 TEMP21-40.37 | v35.66,42.82 35.66,41.4 35.87,41.2 35.87,38.15
  Bottom 0.203: v57.4,13.16 59.84,13.16 63.91,17.22 65.94,17.22 67.36,18.64 67.36,30.43 54.76,43.03 54.76,47.3 53.14,48.92 27.33,48.92 26.72,48.31 26.72,45.26 29.16,42.82 v35.66,42.82
TEMP40  (via drill 0.51)
  Top 0.203: R40.2 35.05,36.12 37.49,36.12 MUX5.4 37.69,36.12 38.3,36.12 38.91,35.51 38.91,34.49 38.71,34.29 36.27,34.29 36.07,34.09 36.07,31.32 v34.21,29.46
  Bottom 0.203: v34.21,29.46 34.21,29.11 35.87,27.46 38.51,27.46 39.37,26.59 53.54,12.55 53.54,11.73 52.73,10.92 TEMP21-40.39
TEMP_OUT1
  Top 0.203: MUX1.3 18.59,52.78 19.2,52.78 20.02,53.59 20.02,55.63 13.92,61.72 13.31,61.72 TEMP_OUT.1
TEMP_OUT2  (via drill 0.51)
  Top 0.203: v39.32,52.58 37.69,52.58 MUX2.3 | v39.32,54.2 39.32,56.64 30.99,64.97 22.66,64.97 19.61,61.92 17.58,61.92 TEMP_OUT.2
  Bottom 0.203: v39.32,54.2 v39.32,52.58
TEMP_OUT3  (via drill 0.51)
  Top 0.203: v35.87,78.79 53.14,78.79 69.8,62.13 69.8,48.11 69.6,47.9 65.94,47.9 64.31,49.53 61.47,49.53 58.42,52.58 56.79,52.58 MUX3.3
  Bottom 0.203: v35.87,78.79 28.35,78.79 23.06,73.51 23.06,63.35 21.64,61.92 TEMP_OUT.3
TEMP_OUT4
  Top 0.203: MUX4.3 18.39,37.54 17.78,37.54 16.56,38.76 16.56,41.94 10.52,47.98 10.52,63.2 13.31,65.99 TEMP_OUT.4
TEMP_OUT5  (via drill 0.51)
  Top 0.203: v35.05,45.26 38.91,41.4 38.91,38.15 38.3,37.54 37.69,37.54 MUX5.3 | v28.55,45.26 14.25,45.26 11.23,48.28 11.23,62.74 12.83,64.34 15.72,64.34 17.37,65.99 TEMP_OUT.5
  Bottom 0.203: v28.55,45.26 v35.05,45.26
VCC  (via drill 0.51)
  Top 0.203: 31.8,49.1 31.8,42.01 v31.88,41.81
  Top 0.61: v64.49,55.24 MUX3.16 | R20.1 R17.1 R18.1 R19.1 68.79,57.14 v68.78,57.15 | 50.72,55.24 R11.1 R10.1 R9.1 R12.1 R22.1 R24.1 R23.1 R21.1 50.72,55.24 | 31.9,40.16 R37.1 R39.1 R40.1 R38.1 R28.1 R25.1 30.82,38.08 R26.1 30.82,38.12 R27.1 31.9,40.16 | R36.1 R33.1 R34.1 R35.1 49.15,40.22 v49.15,41.81 | R6.1 13.17,49.17 R8.1 R7.1 R5.1 13.08,55.41 v13.08,57.12 | R30.1 R32.1 R31.1 R29.1 13.22,41.67 v13.08,41.81 | v45.7,55.24 MUX2.16 | v50.8,57.2 50.8,55.32 50.72,55.24 | v26.64,55.24 MUX1.16 | v31.88,41.81 31.9,41.78 31.9,40.16 | v26.67,40.06 26.62,40.01 MUX4.16 | v45.44,40.08 45.36,40.01 MUX5.16 | R3.1 R2.1 R1.1 R4.1 31.8,49.1 R14.1 32.96,51.13 R16.1 R15.1 R13.1 R3.1
  Bottom 0.61: 50.8,55.24 v64.49,55.24 65.56,55.24 | 50.8,55.24 v45.7,55.24 v26.64,55.24 13.08,55.24 | 50.8,55.24 v50.8,57.2 | 13.08,55.24 v13.08,57.12 | 13.08,55.24 v13.08,41.81 26.67,41.81 | 26.67,41.81 v31.88,41.81 45.44,41.81 | 26.67,41.81 v26.67,40.06 | 45.44,41.81 v45.44,40.08 | 45.44,41.81 v49.15,41.81 | 65.56,57.15 65.81,57.15 v68.78,57.15
  Bottom 0.813: VCC/GND.1 65.81,64.06 65.81,57.15 | 65.56,57.15 65.56,55.24

### Text on the board
tNames: VCC/GND: / 1. VCC / 2. GND | 1. | Author: github.com/michaelpass | Temperature Multiplexer (TEMP) / Rev. A, May 5th, 2019 | CS.2: / 1. CS_A_OUT / 2. CS_B_OUT / 3. CS_C_OUT | CS.1: / 1. CS_A_IN / 2. CS_B_IN / 3. CS_C_IN